# EAGLE design TIPO BLE (EAGLE 9.5.2)
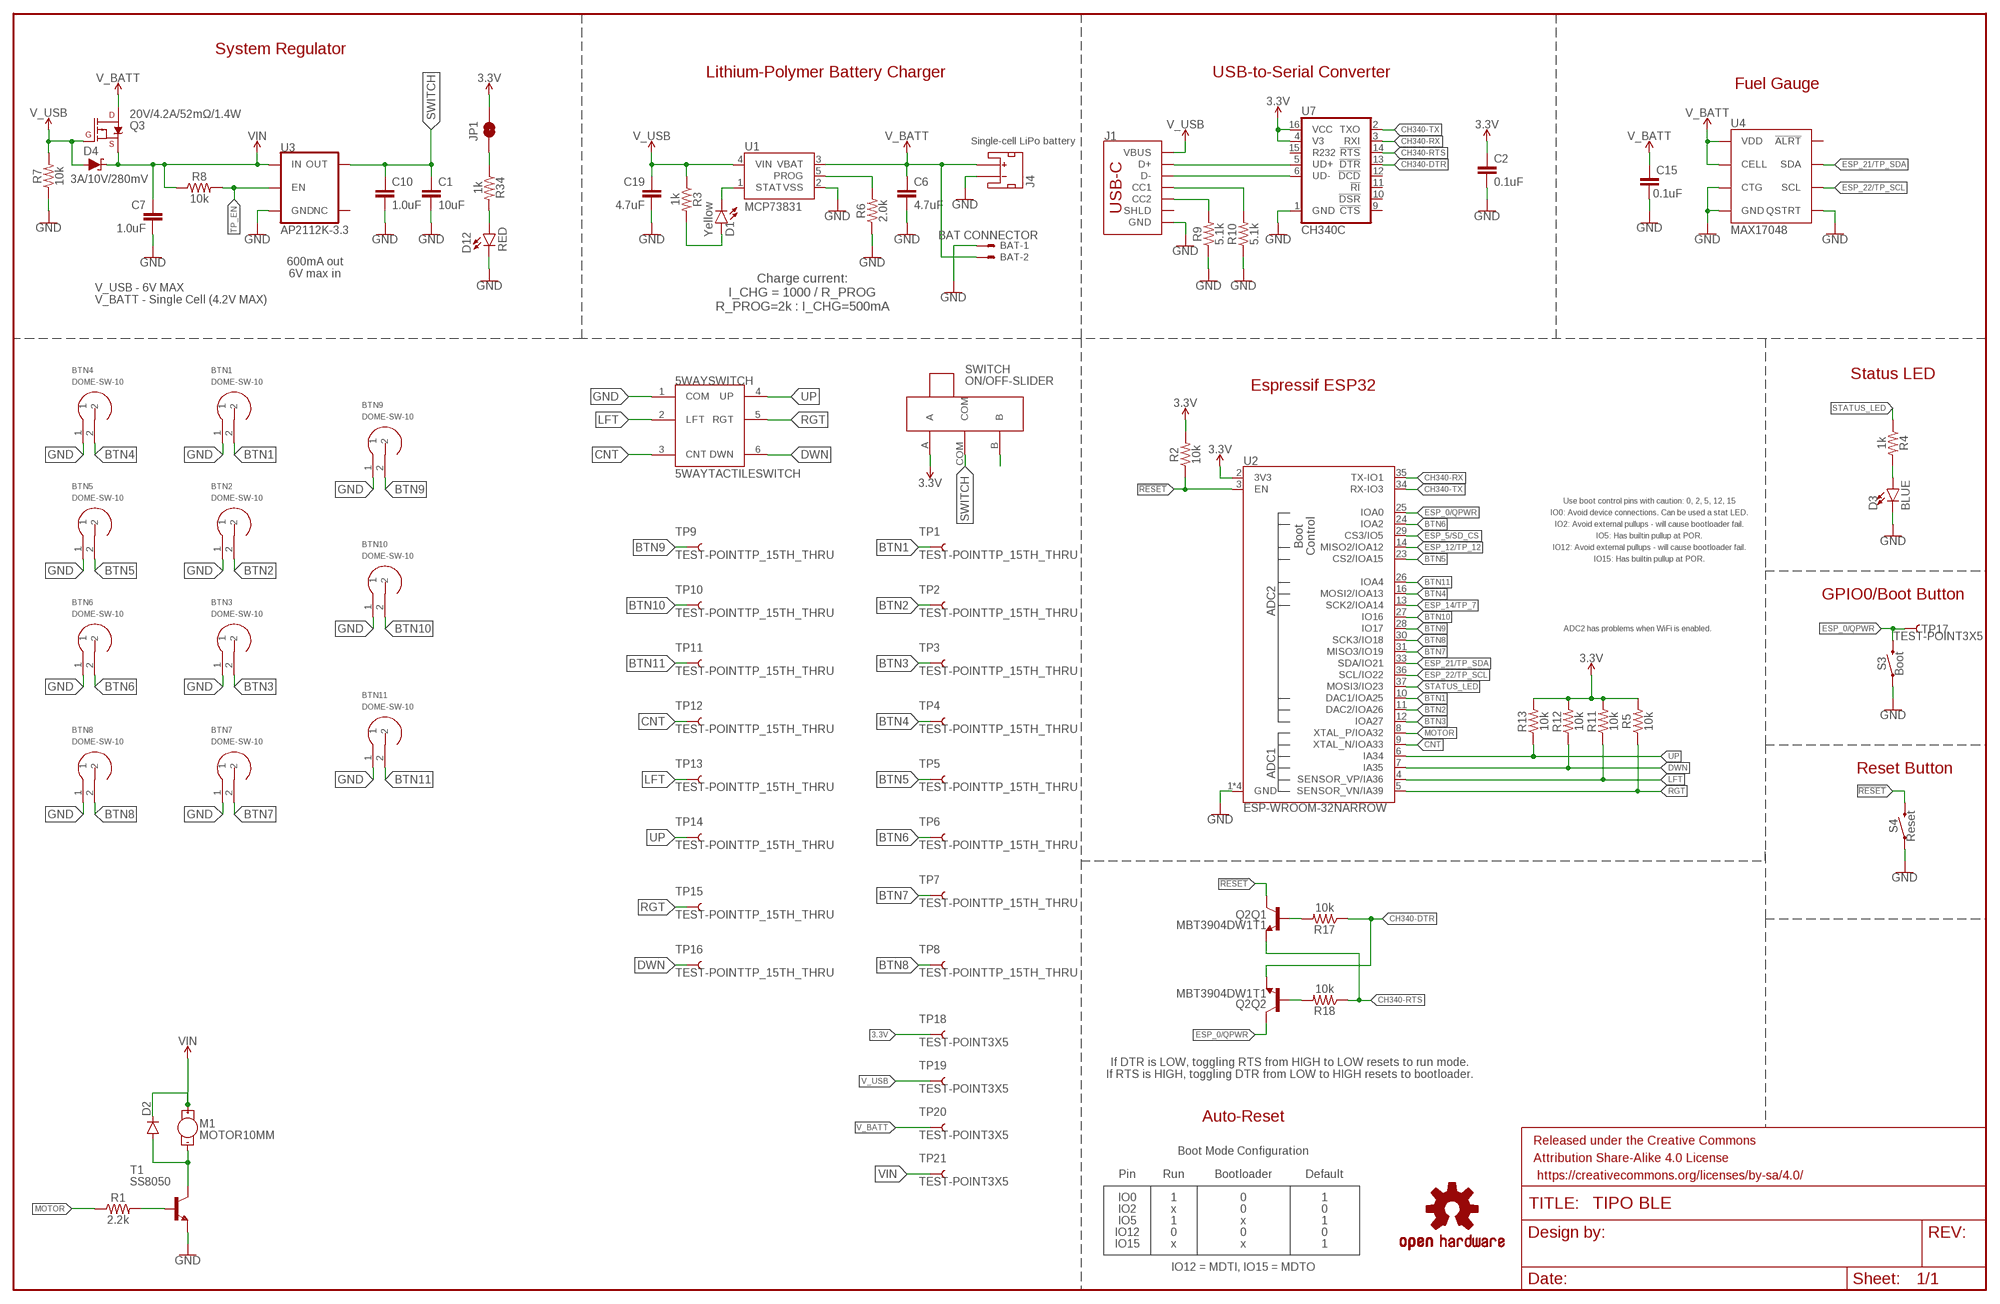
[diagram p0: schematic, sheet 1]

## Parts
5WAYSWITCH  5WAYTACTILESWITCH  [5WAYTACTILESWITCH]
BAT  BAT CONNECTOR  JST-XH-02-PIN-LONG-PAD  [JST-XH-02-PACKAGE-LONG-PAD]
BTN1  DOME-SW-10  [DOME-SW-10]
BTN2  DOME-SW-10  [DOME-SW-10]
BTN3  DOME-SW-10  [DOME-SW-10]
BTN4  DOME-SW-10  [DOME-SW-10]
BTN5  DOME-SW-10  [DOME-SW-10]
BTN6  DOME-SW-10  [DOME-SW-10]
BTN7  DOME-SW-10  [DOME-SW-10]
BTN8  DOME-SW-10  [DOME-SW-10]
BTN9  DOME-SW-10  [DOME-SW-10]
BTN10  DOME-SW-10  [DOME-SW-10]
BTN11  DOME-SW-10  [DOME-SW-10]
C1  10uF  10UF-0402T-6.3V-20%  [0402-TIGHT]
C2  0.1uF  0.1UF-0402T-6.3V-10%-X7R  [0402-TIGHT]
C6  4.7uF  4.7UF-0402_TIGHT-6.3V-20%-X5R  [0402-TIGHT]
C7  1.0uF  1.0UF-0402T-16V-10%  [0402-TIGHT]
C10  1.0uF  1.0UF-0402T-16V-10%  [0402-TIGHT]
C15  0.1uF  0.1UF-0402T-16V-10%  [0402-TIGHT]
C19  4.7uF  4.7UF-0603-35V-(20%)  [0603]
D1  Yellow  LED-YELLOW0603  [LED-0603]
D2  DIODE-DO-214AC  [DO-214AC]
D3  BLUE  LED-BLUE0603  [LED-0603]
D4  3A/10V/280mV  DIODE-SCHOTTKY-BAT60A  [SOD-323]
D12  RED  LED-RED0603  [LED-0603]
FRAME1  FRAME-LEDGER  [CREATIVE_COMMONS]
J1  USB_C_2-LAYER_PADS  [USB-C-16P-2LAYER-PADS]
J4  JST_2MM_MALE  [JST-2-SMD@1]
JP1  JUMPER-SMT_2_NC_TRACE_SILK  [SMT-JUMPER_2_NC_TRACE_SILK]
LOGO1  OSHW-LOGOL  [OSHW-LOGO-L]
M1  MOTOR10MM  [VIBE-MOTOR-10MM]
Q2  MBT3904DW1T1  TRANS_NPN_DUAL-MBT3904DW1T1  [SC70-6]
Q3  20V/4.2A/52mΩ/1.4W  MOSFET_PCH-DMG2305UX-7  [SOT23-3]
R1  2.2k  2.2KOHM-0603-1/10W-1%  [0603]
R2  10k  10KOHM-0402T-1/16W-1%  [0402-TIGHT]
R3  1k  1KOHM-0402T-1/16W-1%  [0402-TIGHT]
R4  1k  1KOHM-0402T-1/16W-1%  [0402-TIGHT]
R5  10k  10KOHM-0402T-1/16W-1%  [0402-TIGHT]
R6  2.0k  2.0KOHM-0603-1/10W-5%  [0603]
R7  10k  10KOHM-0402T-1/16W-1%  [0402-TIGHT]
R8  10k  10KOHM-0402T-1/16W-1%  [0402-TIGHT]
R9  5.1k  5.1KOHM-0402T-1/16W-1%  [0402-TIGHT]
R10  5.1k  5.1KOHM-0402T-1/16W-1%  [0402-TIGHT]
R11  10k  10KOHM-0402T-1/16W-1%  [0402-TIGHT]
R12  10k  10KOHM-0402T-1/16W-1%  [0402-TIGHT]
R13  10k  10KOHM-0402T-1/16W-1%  [0402-TIGHT]
R17  10k  10KOHM-0402T-1/16W-1%  [0402-TIGHT]
R18  10k  10KOHM-0402T-1/16W-1%  [0402-TIGHT]
R34  1k  1KOHM-0402T-1/16W-1%  [0402-TIGHT]
S3  Boot  MOMENTARY-SWITCH-SPST-SMD-4.6X2.8MM  [TACTILE_SWITCH_SMD_4.6X2.8MM]
S4  Reset  MOMENTARY-SWITCH-SPST-SMD-4.6X2.8MM  [TACTILE_SWITCH_SMD_4.6X2.8MM]
SWITCH  ON/OFF-SLIDER  [ON/OFF-SLIDER]
T1  SS8050  BC850  [SOT23]
TP1  TEST-POINTTP_15TH_THRU  [TP_15TH]
TP2  TEST-POINTTP_15TH_THRU  [TP_15TH]
TP3  TEST-POINTTP_15TH_THRU  [TP_15TH]
TP4  TEST-POINTTP_15TH_THRU  [TP_15TH]
TP5  TEST-POINTTP_15TH_THRU  [TP_15TH]
TP6  TEST-POINTTP_15TH_THRU  [TP_15TH]
TP7  TEST-POINTTP_15TH_THRU  [TP_15TH]
TP8  TEST-POINTTP_15TH_THRU  [TP_15TH]
TP9  TEST-POINTTP_15TH_THRU  [TP_15TH]
TP10  TEST-POINTTP_15TH_THRU  [TP_15TH]
TP11  TEST-POINTTP_15TH_THRU  [TP_15TH]
TP12  TEST-POINTTP_15TH_THRU  [TP_15TH]
TP13  TEST-POINTTP_15TH_THRU  [TP_15TH]
TP14  TEST-POINTTP_15TH_THRU  [TP_15TH]
TP15  TEST-POINTTP_15TH_THRU  [TP_15TH]
TP16  TEST-POINTTP_15TH_THRU  [TP_15TH]
TP17  TEST-POINT3X5  [PAD.03X.05]
TP18  TEST-POINT3X5  [PAD.03X.05]
TP19  TEST-POINT3X5  [PAD.03X.05]
TP20  TEST-POINT3X5  [PAD.03X.05]
TP21  TEST-POINT3X5  [PAD.03X.05]
U1  MCP73831  [SOT23-5]
U2  ESP-WROOM-32NARROW  [ESP-WROOM-32-NARROW]
U3  AP2112K-3.3  V_REG_AP2112K-3.3V  [SOT23-5]
U4  MAX17048  MAX17048DFN8  [DFN-8]
U7  CH340C  [SO016]

## Nets
3.3V [power]: C2.1 JP1.2 R2.2 R5.2 R11.2 R12.2 R13.2 SWITCH.A TP18.1 U2.2(3V3) U7.4(V3) U7.16(VCC)
!RESET!: Q2.3(Q1:C) R2.1 S4.3 S4.4 U2.3(EN)
BTN1: BTN1.2 TP1.1 U2.10(DAC1/IOA25)
BTN2: BTN2.2 TP2.1 U2.11(DAC2/IOA26)
BTN3: BTN3.2 TP3.1 U2.12(IOA27)
BTN4: BTN4.2 TP4.1 U2.16(MOSI2/IOA13)
BTN5: BTN5.2 TP5.1 U2.23(CS2/IOA15)
BTN6: BTN6.2 TP6.1 U2.24(IOA2)
BTN7: BTN7.2 TP7.1 U2.31(MISO3/IO19)
BTN8: BTN8.2 TP8.1 U2.30(SCK3/IO18)
BTN9: BTN9.2 TP9.1 U2.28(IO17)
BTN10: BTN10.2 TP10.1 U2.27(IO16)
BTN11: BTN11.2 TP11.1 U2.26(IOA4)
CH340-DTR: Q2.1(Q2:E) R17.1 U7.13(!DTR)
CH340-RTS: Q2.4(Q1:E) R18.1 U7.14(!RTS)
CH340-RX: U2.35(TX-IO1) U7.3(RXI)
CH340-TX: U2.34(RX-IO3) U7.2(TXO)
CHG: D1.C U1.1(STAT)
CHG_LED: D1.A R3.2
CNT: 5WAYSWITCH.3(CNT) TP12.1 U2.9(XTAL_N/IOA33)
D+: J1.A6(D+) J1.B6(D+) U7.5(UD+)
D-: J1.A7(D-) J1.B7(D-) U7.6(UD-)
DTR-10K: Q2.5(Q1:B) R17.2
DWN: 5WAYSWITCH.6(DWN) R12.1 TP16.1 U2.7(IA35)
ESP_0/QPWR: Q2.6(Q2:C) S3.3 S3.4 TP17.1 U2.25(IOA0)
ESP_5/SD_CS: U2.29(CS3/IO5)
ESP_12/TP_12: U2.14(MISO2/IOA12)
ESP_14/TP_7: U2.13(SCK2/IOA14)
ESP_21/TP_SDA: U2.33(SDA/IO21) U4.8(SDA)
ESP_22/TP_SCL: U2.36(SCL/IO22) U4.7(SCL)
GND: 5WAYSWITCH.1(COM) BAT.1 BTN1.1 BTN2.1 BTN3.1 BTN4.1 BTN5.1 BTN6.1 BTN7.1 BTN8.1 BTN9.1 BTN10.1 BTN11.1 C1.2 C2.2 C6.2 C7.2 C10.2 C15.2 C19.2 D3.C D12.C J1.GND J1.GND2(GND) J4.1(-) R6.1 R7.1 R9.1 R10.1 S3.1 S3.2 S4.1 S4.2 T1.2(E) U1.2(VSS) U2.1(GND) U2.15(GND) U2.38(GND) U2.GND U3.2(GND) U4.1(CTG) U4.4(GND) U4.6(QSTRT) U4.9(GND) U7.1(GND)
LFT: 5WAYSWITCH.2(LFT) R11.1 TP13.1 U2.4(SENSOR_VP/IA36)
MOTOR: R1.1 U2.8(XTAL_P/IOA32)
N$1: R1.2 T1.1(B)
N$2: SWITCH.B
N$3: D2.A M1.- T1.3(C)
N$4: JP1.1 R34.1
N$5: J1.B5(CC2) R9.2
N$6: J1.A5(CC1) R10.2
N$7: D3.A R4.2
N$14: R6.2 U1.5(PROG)
N$30: D12.A R34.2
RGT: 5WAYSWITCH.5(RGT) R5.1 TP15.1 U2.5(SENSOR_VN/IA39)
RTS-10K: Q2.2(Q2:B) R18.2
STATUS_LED: R4.1 U2.37(MOSI3/IO23)
SWITCH [power]: C1.1 C10.1 SWITCH.COM U3.5(OUT)
TP_EN: R8.2 U3.3(EN)
UP: 5WAYSWITCH.4(UP) R13.1 TP14.1 U2.6(IA34)
V_BATT [power]: BAT.2 C6.1 C15.1 J4.2(+) Q3.3(D) TP20.1 U1.3(VBAT) U4.2(CELL) U4.3(VDD)
V_USB [power]: C19.1 D4.A J1.VBUS1(VBUS) J1.VBUS2(VBUS) Q3.1(G) R3.1 R7.2 TP19.1 U1.4(VIN)
VIN [power]: C7.1 D2.C D4.C M1.+ Q3.2(S) R8.1 TP21.1 U3.1(IN)
Unconnected: J1.SHLD1(SHLD) J1.SHLD2(SHLD) J1.SHLD3(SHLD) J1.SHLD4(SHLD) J4.NC1(PAD1) J4.NC2(PAD2) U3.4(NC) U4.5(!ALRT) U7.9(!CTS) U7.10(!DSR) U7.11(!RI) U7.12(!DCD) U7.15(R232)

## Notes on the sheet
- System Regulator
- Lithium-Polymer Battery Charger | USB-to-Serial Converter
- Fuel Gauge
- Single-cell LiPo battery
- 600mA out
  6V max in
- Charge current:
  I_CHG = 1000 / R_PROG
  R_PROG=2k : I_CHG=500mA
- V_USB - 6V MAX
  V_BATT - Single Cell (4.2V MAX)
- Status LED
- Espressif ESP32
- Use boot control pins with caution: 0, 2, 5, 12, 15
- IO0: Avoid device connections. Can be used a stat LED.
- IO2: Avoid external pullups - will cause bootloader fail.
- IO5: Has builtin pullup at POR.
- IO12: Avoid external pullups - will cause bootloader fail.
- IO15: Has builtin pullup at POR.
- GPIO0/Boot Button
- ADC2 has problems when WiFi is enabled.
- Reset Button
- If DTR is LOW, toggling RTS from HIGH to LOW resets to run mode.
  If RTS is HIGH, toggling DTR from LOW to HIGH resets to bootloader.
- Auto-Reset
- Boot Mode Configuration
- Pin | Run | Bootloader | Default
- IO0 | 1 | 0 | 1
- IO2 | x | 0 | 0
- IO5 | 1 | x | 1
- IO12 | 0 | 0 | 0
- IO15 | x | x | 1
- IO12 = MDTI, IO15 = MDTO

## Library data of the parts
5WAYSWITCH = tipo-switch:5WAYTACTILESWITCH: Sometimes you want a small input and a single button just won’t fit it. A 5-way tactile switch allows for a joystick-like interface in a very small package. These are surface mount, but easily soldered. This navigation switch is an intuitive way to add 5 button's worth of interfacing with a single component. Inside is 5 switches: left, right, up, down and 'select' (pressing down), all with a common ground pin. https://www.sunrom.com/p/5-way-tactile-switch-10x10x9mm
BAT = Rembrandt Electronics - JST XH Connectors v1-0:JST-XH-02-PIN: JST XH Connector 2 Pin Wire to board connector. Pitch: 2,54 mm, (0.100") Number of pins: 2 Created by Rembrandt Electronics www.rembrandtelectronics.com
BTN1-BTN11 = tipo-switch:DOME-SW-10: Dome Switch 10mm https://www.sunrom.com/p/dome-switch-round-10mm
C1 = SparkFun-Capacitors:10UF: 10.0µF ceramic capacitors A capacitor is a passive two-terminal electrical component used to store electrical energy temporarily in an electric field.; PROD_ID: CAP-14848
C2 = SparkFun-Capacitors:0.1UF: 0.1µF ceramic capacitors A capacitor is a passive two-terminal electrical component used to store electrical energy temporarily in an electric field.; PROD_ID: CAP-14993
C6 = SparkFun-Capacitors:4.7UF: 4.7µF ceramic capacitors A capacitor is a passive two-terminal electrical component used to store electrical energy temporarily in an electric field.; PROD_ID: CAP-14240
C7 C10 = SparkFun-Capacitors:1.0UF: 1µF ceramic capacitors A capacitor is a passive two-terminal electrical component used to store electrical energy temporarily in an electric field.; PROD_ID: CAP-12417
C15 = SparkFun-Capacitors:0.1UF: 0.1µF ceramic capacitors A capacitor is a passive two-terminal electrical component used to store electrical energy temporarily in an electric field.; PROD_ID: CAP-12416
C19 = SparkFun-Capacitors:4.7UF: 4.7µF ceramic capacitors A capacitor is a passive two-terminal electrical component used to store electrical energy temporarily in an electric field.; PROD_ID: CAP-14106
D1 = SparkFun-LED:LED-YELLOW: Yellow SMD LED Used in manufacturing several products at SparkFun. Packages: 0603 - SMD 0603 package[Product Link] <http://www.kingbrightusa.com/product.asp?catalog_name=LED&product_id=APT1608SYCK> 0603 -SMART - SMART SMD 0603 package (more efficient/more expensive) [Product Link] <http://www.osram-os.com/osram_os/en/products/product-catalog/led-light-emitting-diodes/smartled-0603/ly-l29k/index.jsp> LilyPad - SMD1206 package[Product Datasheet] <https://www.sparkfun.com/datasheets/DevTools/LilyPad/Q150YUS4.pdf> SparkFun Products: Blynk Board <https://www.sparkfun.com/products/13794> IOIO-OTG <https://www.sparkfun.com/products/13613> XBee Explorer Serial <https://www.sparkfun.com/products/13225>; PROD_ID: DIO-09003
D2 = diode:DIODE-: DIODE
D3 = SparkFun-LED:LED-BLUE: Blue SMD LED Used in manufacturing of various products at SparkFun Packages: 0603 - SMD 0603 package [Product Link] <http://www.digikey.com/product-detail/en/SMLE12BC7TT86/511-1589-2-ND/1641808> 1206 - SMD1206 package [Product Link] <http://www.digikey.com/product-detail/en/lite-on-inc/LTST-C150TBKT/160-1643-1-ND/573584> SparkFun Products: ESP8266 Thing-Dev Board <https://www.sparkfun.com/products/13711> RedBoard <https://www.sparkfun.com/products/12757>; PROD_ID: DIO-08575
D4 = SparkFun-DiscreteSemi:DIODE-SCHOTTKY: Schottky diode A Schottky diode is a semiconductor diode which has a low forward voltage drop and a very fast switching action.; PROD_ID: DIO-14072
D12 = SparkFun-LED:LED-RED: Red SMD LED Used in manufacturing of most products at SparkFun Packages: 0603 - SMD 0603 package [Product Link] <http://docs.avagotech.com/docs/AV02-0551EN> 0603 SMART - SMD 0603 SMART package ( more efficient and expensive)[Product Link] <http://www.osram-os.com/Graphics/XPic2/00077099_0.pdf> 1206 - SMD1206 package [Product Link] <https://www.sparkfun.com/datasheets/DevTools/LilyPad/Q150OVS4.pdff> SparkFun Products: Pro Mini 328 -5V <https://www.sparkfun.com/products/821> RedBoard <https://www.sparkfun.com/products/12757> IOIO-OTG <https://www.sparkfun.com/products/13613>; PROD_ID: DIO-00819
FRAME1 = SparkFun-Aesthetics:FRAME-LEDGER: Schematic Frame - Ledger Standard 11x14 US Ledger frame
J1 = SparkFun-Connectors:USB_C: USB Type C 16Pin Connector Super Speed pins not available on the 16-pin purely SMD connector so this part is best for USB 2.0 implementations. D1 and D2 are tied together enabling D+/- no matter which way the cable is plugged into the connector. The two channel configuration pins (CC1/2) are exposed. These are normally connected to ground via 5.1k resistors but can be reconfigured for high current/high power applications. **4-LAYER BOARD WARNING!!** If designing 4-layer board, make sure to select the variant _4-LAYER-ISOLATED. The linked footprint (USB-C-16-4LAYER-ISOLATED) includes some very necessary cutout polygons in the inner layers (2 and 15). This prevents the PTH mounting shield legs on the USB connector from electrically connecting any other polygons on the inner layers (usually VCC and GND).; PROD_ID: CONN-14122
J4 = SparkFun-Connectors:JST_2MM_MALE: JST 2MM MALE RA CONNECTOR Two pin, compact surface mount connector. Commonly used as a battery input connection point. We really like the solid locking feeling and high current rating on these small connectors. We use these all the time as battery connectors. Mates to single-cell LiPo batteries. Here is the connector we sell at SparkFun: JST Right Angle Connector - White (PRT-08612) Datasheet It was used on these SparkFun products: SparkFun MOSFET Power Controller (PRT-11214) SparkFun Battery Babysitter - LiPo Battery Manager (PRT-13777) And many, many others that required a lipo battery connection.; PROD_ID: CONN-11443; SF_ID: PRT-08612
JP1 = SparkFun-Jumpers:JUMPER-SMT_2_NC_TRACE: Normally closed trace jumper This jumper has a trace between two pads so it's normally closed (NC). Use a razor knife to open the connection. For best results follow the IPC guidelines for cutting traces: Cutout at least 0.063 mm (0.005 in). Remove all loose material to clean up the cut area. Seal the cut with an approved epoxy. Reapply solder to reclose the connection.
LOGO1 = SparkFun-Aesthetics:OSHW-LOGO: Open-Source Hardware (OSHW) Logo This logo indicates the piece of hardware it is found on incorporates a OSHW license and/or adheres to the definition of open source hardware found here: http://freedomdefined.org/OSHW
M1 = SparkFun-Electromechanical:MOTOR: Motor (Single-Phase) Two-terminal, single-phase motors. SparkFun Products Vibration Motor (ROB-08449) Physical dimension and wire connections for this powerful vibration motor. Motor has a self adhesive backing.; PROD_ID: COMP-08572; SF_SKU: ROB-08449
Q2 = SparkFun-DiscreteSemi:TRANS_NPN_DUAL: Dual NPN Transistors in Single Package The MBT3904W1 puts two general purpose 3904 NPN transistors in a single package. Datasheet <http://www.onsemi.com/pub_link/Collateral/MBT3904DW1T1-D.PDF> SparkFun Products: SparkFun ESP32 Thing <https://www.sparkfun.com/products/13907>; PROD_ID: TRANS-13337
Q3 = SparkFun-DiscreteSemi:MOSFET_PCH: P-channel MOSFETs Voltage controlled devices that allow control of high current outputs. SparkFun Products: SparkFun ESP32 Thing <https://www.sparkfun.com/products/13907> SparkFun ESP8266 Thing <https://www.sparkfun.com/products/13231> SparkFun Pi Servo HAT V2 <https://www.sparkfun.com/products/15316> DMG2305UX-7 (20V/4.2A/SOT23-3); PROD_ID: TRAN-14388
R1 = SparkFun-Resistors:2.2KOHM: 2.2kΩ resistor A resistor is a passive two-terminal electrical component that implements electrical resistance as a circuit element. Resistors act to reduce current flow, and, at the same time, act to lower voltage levels within circuits. - Wikipedia; PROD_ID: RES-08272
R2 R5 R7 R8 R11-R13 R17 R18 = SparkFun-Resistors:10KOHM: 10kΩ resistor A resistor is a passive two-terminal electrical component that implements electrical resistance as a circuit element. Resistors act to reduce current flow, and, at the same time, act to lower voltage levels within circuits. - Wikipedia; PROD_ID: RES-14241
R3 R4 R34 = SparkFun-Resistors:1KOHM: 1kΩ resistor A resistor is a passive two-terminal electrical component that implements electrical resistance as a circuit element. Resistors act to reduce current flow, and, at the same time, act to lower voltage levels within circuits. - Wikipedia; PROD_ID: RES-14342
R6 = SparkFun-Resistors:2.0KOHM: 2kΩ resistor A resistor is a passive two-terminal electrical component that implements electrical resistance as a circuit element. Resistors act to reduce current flow, and, at the same time, act to lower voltage levels within circuits. - Wikipedia; PROD_ID: RES-08296
R9 R10 = SparkFun-Resistors:5.1KOHM; PROD_ID: RES-14340
S3 S4 = SparkFun-Switches:MOMENTARY-SWITCH-SPST: Momentary Switch (Pushbutton) - SPST Normally-open (NO) SPST momentary switches (buttons, pushbuttons). Variants PTH-12MM - 12mm square, through-hole Momentary Pushbutton Switch - 12mm Square (COM-09190) PTH-6.0MM, PTH-6.0MM-KIT - 6.0mm square, through-hole Mini Pushbutton Switch (COM-00097) KIT package intended for soldering kit's - only one side of pads' copper is exposed. PTH-RIGHT-ANGLE-KIT - Right-angle, through-hole Right Angle Tactile Button - Used on SparkFun BigTime Watch Kit SMD-12MM - 12mm square, surface-mount Tactile Button - SMD (12mm) (COM-12993) Used on SparkFun PicoBoard SMD-4.5MM - 4.5mm Square Trackball Switch Used on SparkFun Blackberry Trackballer Breakout SMD-4.6MMX2.8MM - 4.60mm x 2.80mm, surface mount Used on SparkFun SAMD21 Mini Breakout SMD-5.2MM, SMD-5.2-REDUNDANT - 5.2mm square, surface-mount Mini Pushbutton Switch - SMD (COM-08720) Used on Arduino Pro Mini REDUNDANT package connects both switch circuits together SMD-6.0X3.5MM - 6.0 x 3.5mm, surface mount Momentary Reset Switch SMD (COM-08229) SMD-6.2MM-TALL - 6.2mm square, surface mount Tactile Button - SMD (6mm) Used on SparkFun Digital Sandbox SMD-RIGHT-ANGLE - Right-angle, surface mount Used on SparkFun Block for Intel® Edison - Arduino; PROD_ID: SWCH-15606
SWITCH = tipo-switch:ON/OFF-SLIDER
T1 = transistor:BC850: NPN TRANSISTOR
TP1-TP21 = SparkFun-Connectors:TEST-POINT: SparkFun Test Points Bare copper test points for troubleshooting or In-Circuit-Testing. These are used by our Production team for verifying production board runs using pogo-pins on test beds. SparkFun Products: SparkFun LSM9DS1 Breakout <https://www.sparkfun.com/products/13284> SparkFun PSOC <https://www.sparkfun.com/products/13714> SparkFun Load Cell Amplifier <https://www.sparkfun.com/products/13879>
U1 = SparkFun-PowerIC:MCP73831: Miniature single cell, fully integrated Li-Ion, Li-polymer charge management controller http://ww1.microchip.com/downloads/en/DeviceDoc/20001984g.pdf IC-09995; PROD_ID: IC-09995
U2 = SparkFun-RF:ESP-WROOM-32; PROD_ID: IC-13849
U3 = SparkFun-IC-Power:V_REG_AP2112: AP2112 - 600mA CMOS LDO Regulator w/ Enable The AP2112 is CMOS process low dropout linear regulator with enable function, the regulator delivers a guaranteed 600mA (min.) continuous load current. Features Output Voltage Accuracy: ±1.5% Output Current: 600mA (Min.) Foldback Short Current Protection: 50mA Enable Function to Turn ON/OFF VOUT Low Dropout Voltage (3.3V): 250mV (Typ.) @IOUT=600mA Excellent Load Regulation: 0.2%/A (Typ.) Excellent Line Regulation: 0.02%/V (Typ.) Low Quiescent Current: 55μA (Typ.) Low Standby Current: 0.01μA (Typ.) Low Output Noise: 50μVRMS PSRR: 100Hz -65dB, 1kHz -65dB OTSD Protection Stable with 1.0μF Flexible Cap: Ceramic, Tantalum and Aluminum Electrolytic Operation Temperature Range: -40°C to 85°C ESD: MM 400V, HBM 4000V; PROD_ID: VREG-12457; VALUE: 3.3V
U4 = SparkFun-IC-Power:MAX17048: Micropower 1-Cell Li+ ModelGauge SparkFun Products Qduino Mini (DEV-13614); PROD_ID: IC-12551
U7 = SparkFun-IC-Comms:CH340C; PROD_ID: IC-14038

## Net classes
1 power: width 0.305 mm, drill 0.305 mm

## Board
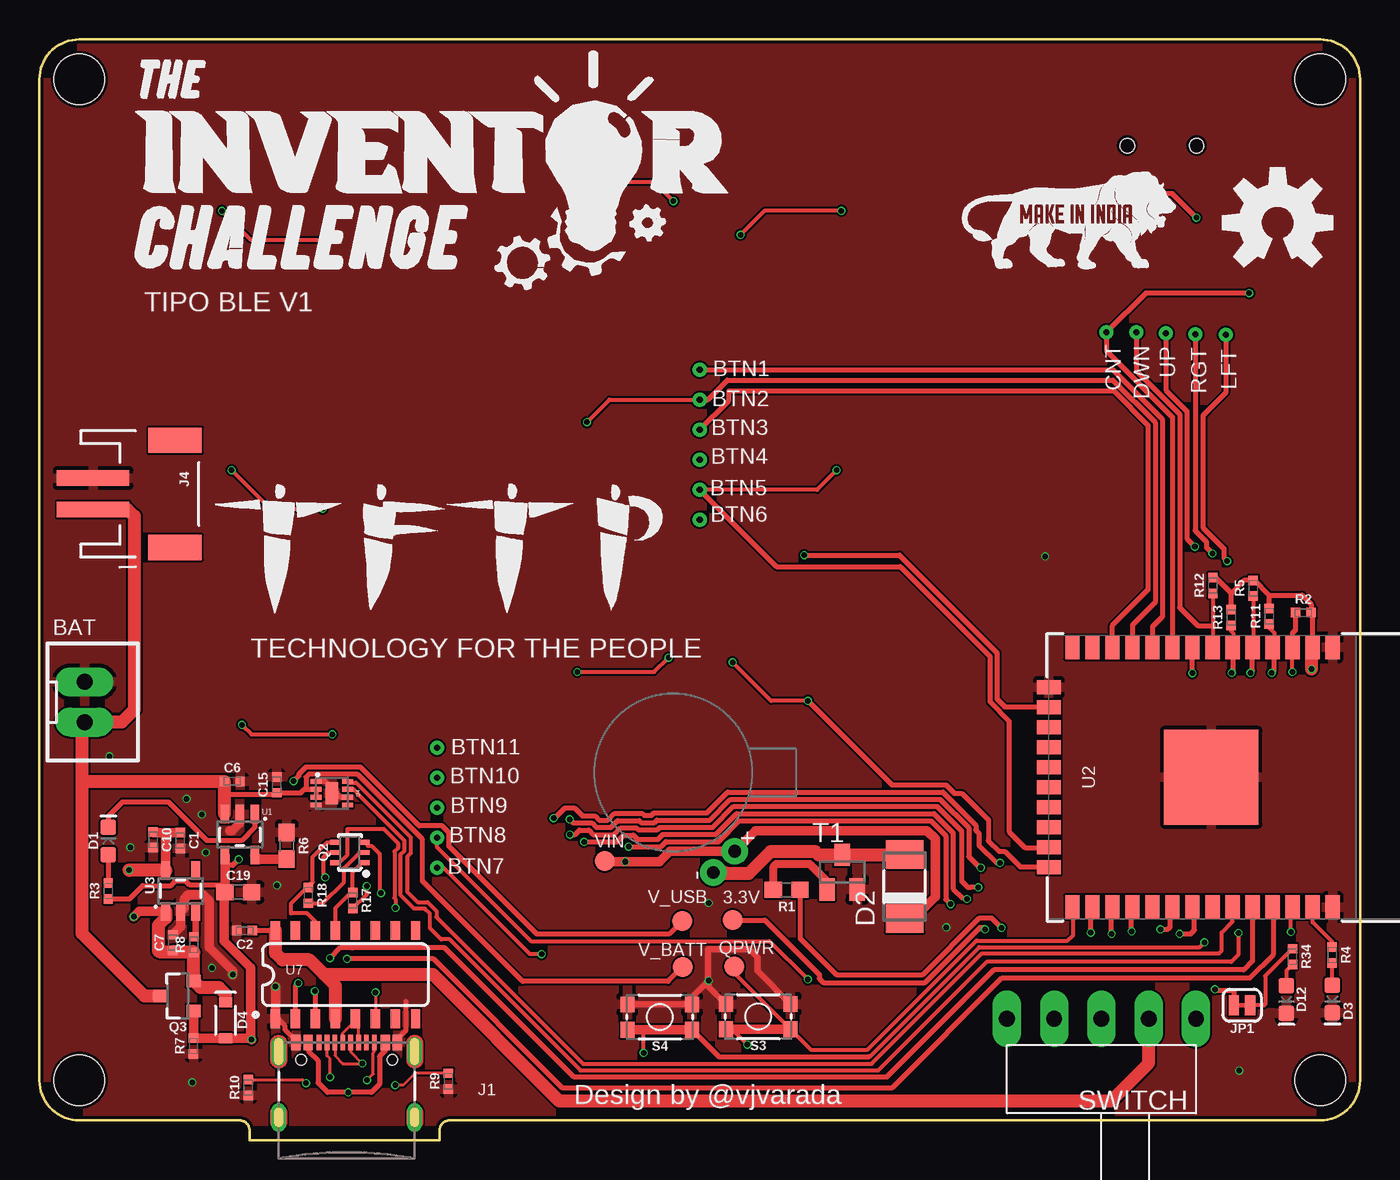
[diagram p1: board, top side]
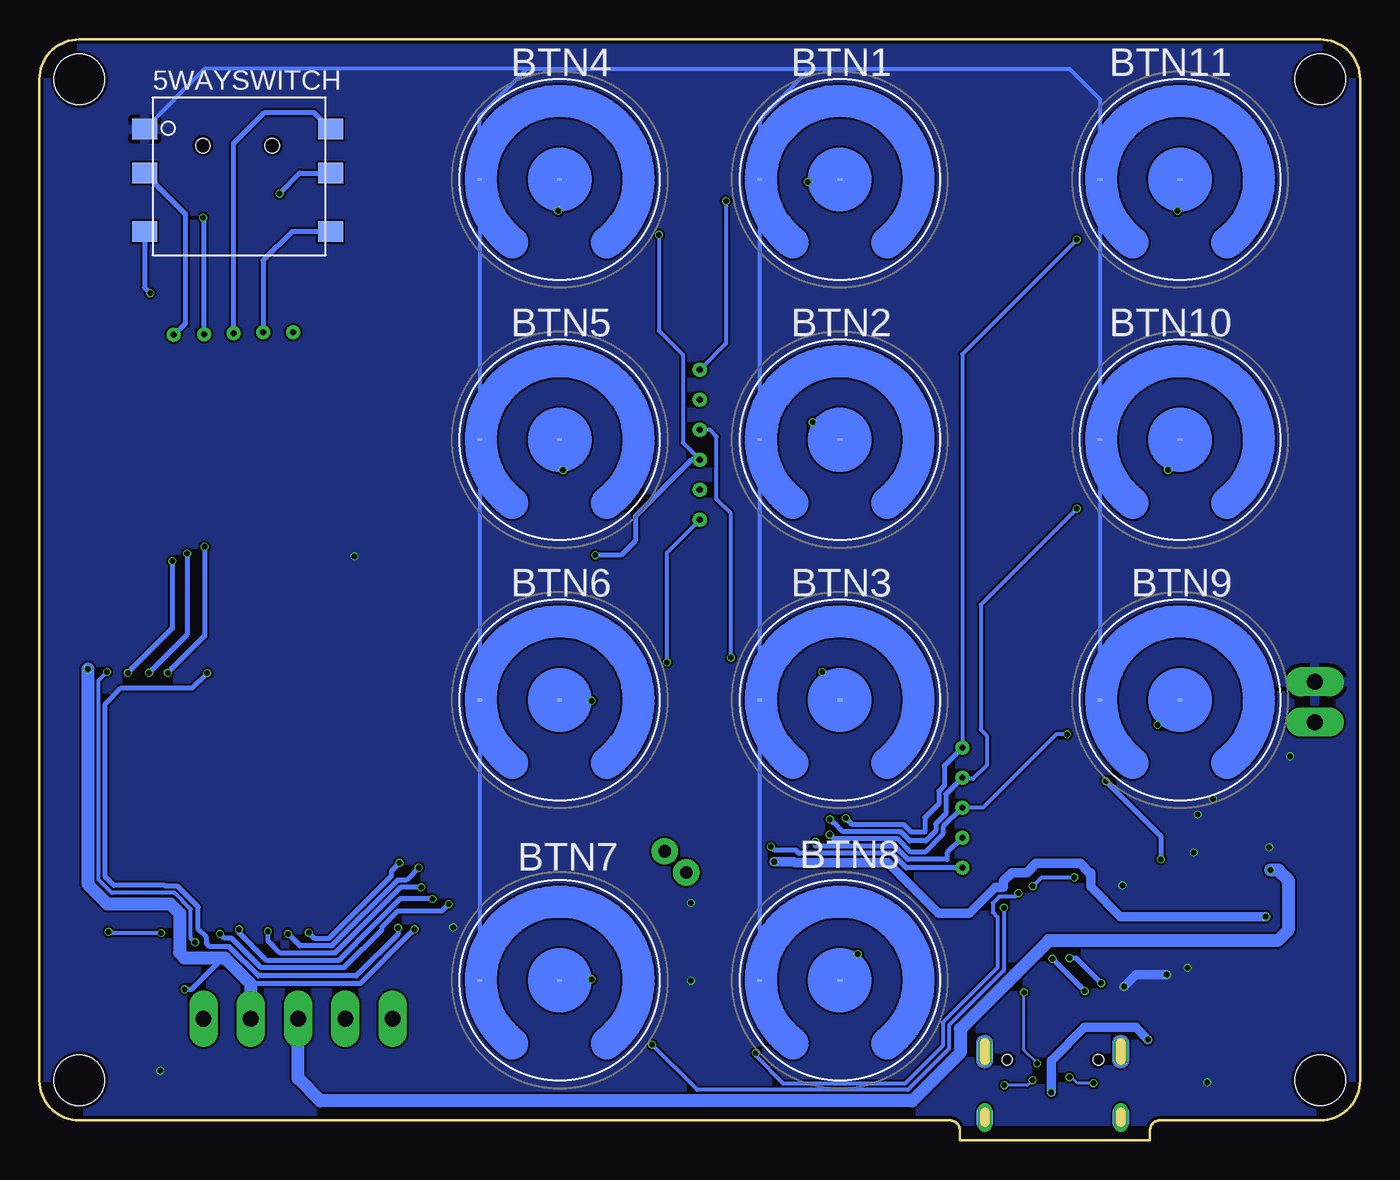
[diagram p2: board, bottom side, seen from below]

Size 83.82 x 69.85 mm. Coordinates in mm from the lower left corner, seen from the top.
Outline: 83.82,67.31 arc90 81.28,69.85 2.54,69.85 arc90 0,67.31 0,3.81 arc90 2.54,1.27 12.7,1.27 arc-90 13.34,0.63 13.34,0 25.4,0 25.4,0.63 arc-90 26.04,1.27 81.28,1.27 arc90 83.82,3.81 83.82,67.31
Copper layers (1*16): Top 0.035mm / dielectric 1.6mm / Bottom 0.035mm
Design rules "jlcpcb-2layers": minimum track width 5mil, minimum drill 0.3mm, track to track 5mil, track to pad 5mil, pad to pad 5mil, via to via 5mil, smd to smd 5mil, copper to edge 0.2mm, drill to drill 6mil, minimum pad ring 10mil, minimum via ring 3mil, stop-mask expansion 4mil, vias tented up to drill 0mil, thermal gap 10mil
Holes 3.2 mm at 2.54,3.81 2.54,67.31 81.28,3.81 81.28,67.31

### Footprints (pad centres in the part's own frame; a part is rotated, then mirrored left to right if it is on the bottom)
5WAYTACTILESWITCH = smd 1.6 x 1.3: 1 0,0; 2 0,-2.8; 3 0,-6.5; 4 11.8,0; 5 11.8,-2.8; 6 11.8,-6.5 | hole 0.9: 3.7,-1.05; 8.1,-1.05
JST-XH-02-PACKAGE-LONG-PAD = drill 1.016 long: 1 -1.27,0; 2 1.27,0
DOME-SW-10 = smd 0.305 x 0.152: 1 -5.08,0; 2 0,0
0402-TIGHT = smd 0.6 x 0.6: 1 -0.5,0; 2 0.5,0
0603 = smd 1.1 x 1: 1 -0.85,0; 2 0.85,0
LED-0603 = smd 1 x 1: A -0.877,0; C 0.877,0
DO-214AC = smd 1.8 x 2.4: A 2.025,0; C -2.025,0
SOD-323 = smd 0.63 x 0.83: A 1.15,0; C -1.15,0
USB-C-16P-2LAYER-PADS = smd 0.3 x 1: A5 -1.25,-0.34; A6 -0.25,-0.34; A7 0.25,-0.34; A8 1.25,-0.34; B5 1.75,-0.34; B6 0.75,-0.34; B7 -0.75,-0.34; B8 -1.75,-0.34 | smd 0.6 x 1: GND -3.225,-0.34; GND2 3.225,-0.34; VBUS1 -2.45,-0.34; VBUS2 2.45,-0.34 | drill 0.4 pad 0.6 long: SHLD1 -4.318,-0.915; SHLD2 4.318,-0.915; SHLD3 -4.318,-5.095; SHLD4 4.318,-5.095 | hole 0.65: -2.89,-1.445; 2.89,-1.445
JST-2-SMD@1 = smd 1 x 4.6: 1 -1,-3.7; 2 1,-3.7 | smd 1.6 x 3.4: NC1 -3.4,1.5; NC2 3.4,1.5
SMT-JUMPER_2_NC_TRACE_SILK = smd 0.66 x 1.27: 1 -0.521,0; 2 0.521,0
VIBE-MOTOR-10MM = drill 0.8 pad 1.676: + -5,-3.9; - -6.35,-2.54
SC70-6 = smd 0.3 x 0.66: 1 -0.65,-0.92; 2 0,-0.92; 3 0.65,-0.92; 4 0.65,0.92; 5 0,0.92; 6 -0.65,0.92
SOT23-3 = smd 0.8 x 0.9: 1 -0.95,-1; 2 0.95,-1; 3 0,1.1
TACTILE_SWITCH_SMD_4.6X2.8MM = smd 0.9 x 1: 1 -2.05,-0.8; 2 2.05,-0.8; 3 2.05,0.8; 4 -2.05,0.8
ON/OFF-SLIDER = drill 1 long: A 3,0; B 9,0; COM 6,0; P$1 0,0; P$5 12,0
SOT23 = smd 1 x 1.4: 1 -0.95,-1.1; 2 0.95,-1.1; 3 0,1.1
TP_15TH = drill 0.381 pad 0.61: 1 0,0
PAD.03X.05 = smd 1.27 x 1.27: 1 0,0
SOT23-5 = smd 0.55 x 1.2: 1 -0.95,-1.3; 2 0,-1.3; 3 0.95,-1.3; 4 0.95,1.3; 5 -0.95,1.3
ESP-WROOM-32-NARROW = smd 0.9 x 1.5: 1 6.43,8.238; 2 5.16,8.238; 3 3.89,8.238; 4 2.62,8.238; 5 1.35,8.238; 6 0.08,8.238; 7 -1.19,8.238; 8 -2.46,8.238; 9 -3.73,8.238; 10 -5,8.238; 11 -6.27,8.238; 12 -7.54,8.238; 13 -8.81,8.238; 14 -10.08,8.238; 25 -10.08,-8.238; 26 -8.81,-8.238; 27 -7.54,-8.238; 28 -6.27,-8.238; 29 -5,-8.238; 30 -3.73,-8.238; 31 -2.46,-8.238; 32 -1.19,-8.238; 33 0.08,-8.238; 34 1.35,-8.238; 35 2.62,-8.238; 36 3.89,-8.238; 37 5.16,-8.238; 38 6.43,-8.238 | smd 1.5 x 0.9: 15 -11.57,5.715; 16 -11.57,4.445; 17 -11.57,3.175; 18 -11.57,1.905; 19 -11.57,0.635; 20 -11.57,-0.635; 21 -11.57,-1.905; 22 -11.57,-3.175; 23 -11.57,-4.445; 24 -11.57,-5.715 | smd 6 x 6: GND -1.27,0
DFN-8 = smd 0.3 x 0.7: 1 -0.75,-0.99; 2 -0.25,-0.99; 3 0.25,-0.99; 4 0.75,-0.99; 5 0.75,0.99; 6 0.25,0.99; 7 -0.25,0.99; 8 -0.75,0.99 | smd 1.38 x 0.8: 9 0,0
SO016 = smd 0.6 x 1.2: 1 -4.445,-2.8; 2 -3.175,-2.8; 3 -1.905,-2.8; 4 -0.635,-2.8; 5 0.635,-2.8; 6 1.905,-2.8; 7 3.175,-2.8; 8 4.445,-2.8; 9 4.445,2.8; 10 3.175,2.8; 11 1.905,2.8; 12 0.635,2.8; 13 -0.635,2.8; 14 -1.905,2.8; 15 -3.175,2.8; 16 -4.445,2.8

### Placement (x,y rotation side)
5WAYSWITCH  77.14,64.16 0 bottom
BAT  2.87,27.81 270 top
BTN1  33.02,60.96 0 bottom
BTN2  33.02,44.45 0 bottom
BTN3  33.02,27.94 0 bottom
BTN4  50.8,60.96 0 bottom
BTN5  50.8,44.45 0 bottom
BTN6  50.8,27.94 0 bottom
BTN7  33.02,10.16 0 bottom
BTN8  50.8,10.16 0 bottom
BTN9  11.43,27.94 0 bottom
BTN10  11.43,44.45 0 bottom
BTN11  11.43,60.96 0 bottom
C1  8.94,19.02 270 top
C2  13.03,13.31 180 top
C6  12.24,22.78 0 top
C7  8.47,12.55 90 top
C10  7.21,19.08 270 top
C15  15.06,22.56 90 top
C19  12.62,15.75 0 top
D1  4.37,19 90 top
D2  54.91,16.1 90 top
D3  82.07,8.97 270 top
D4  11.81,7.62 270 top
D12  79.15,8.94 270 top
FRAME1  43.64,-20.68 0 top  (outside the outline)
J1  19.51,6.55 0 top
J4  7.11,41.02 270 top
JP1  76.33,8.56 180 top
LOGO1  78.59,58.22 0 top
M1  40.23,23.34 90 top
Q2  19.71,18.26 90 top
Q3  8.79,9.17 90 top
R1  47.42,15.9 180 top
R2  80.21,33.48 0 top
R3  4.37,15.82 90 top
R4  82.04,11.76 270 top
R5  77.04,35.03 90 top
R6  15.7,18.69 270 top
R7  9.78,5.99 90 top
R8  9.8,12.42 90 top
R9  25.96,3.76 90 top
R10  13.26,3.35 90 top
R11  78.05,33.25 90 top
R12  74.47,35.2 90 top
R13  75.64,33.17 90 top
R17  19.89,15.21 270 top
R18  17.07,15.54 270 top
R34  79.53,11.66 270 top
S3  45.62,7.85 180 top
S4  39.37,7.82 180 top
SWITCH  73.41,7.72 180 top
T1  50.95,17.02 0 top
TP1  41.91,48.9 0 bottom
TP2  41.91,46.99 0 bottom
TP3  41.91,45.09 0 bottom
TP4  41.91,43.18 0 bottom
TP5  41.91,41.27 0 bottom
TP6  41.91,39.37 0 bottom
TP7  25.25,17.3 180 bottom
TP8  25.25,19.2 180 bottom
TP9  25.25,21.11 180 bottom
TP10  25.25,23.01 180 bottom
TP11  25.25,24.92 180 bottom
TP12  67.72,51.26 270 bottom
TP13  75.29,51.1 270 bottom
TP14  71.5,51.21 270 bottom
TP15  73.36,51.13 270 bottom
TP16  69.62,51.26 270 bottom
TP17  44.09,11.02 0 top
TP18  43.99,13.97 0 top
TP19  40.79,13.92 0 top
TP20  40.82,11 0 top
TP21  35.89,17.73 0 top
U1  12.73,19.41 180 top
U2  75.64,23.04 0 top
U3  8.97,15.82 0 top
U4  18.57,22.02 270 top
U7  19.43,10.52 0 top
U$1  [TFTPLOGO]  13.41,30.63 0 top
U$2  [INVENTORCHALLENGE]  5.72,55.27 0 top
U$3  [MAKEININDIA]  59.54,54.58 0 top

### Tracks (layer width: path | path; a pad name or v marks a point on that pad's centre or on a via)
3.3V  (via drill 0.35)
  Top 0.305: U7.16 C2.1 | 80.82,31.3 80.77,31.25 | v74.6,9.58 74.65,9.52 75.72,9.52 75.81,9.44 JP1.2 | U2.2 80.8,33.39 R2.2 80.71,34.02 80.14,34.59 78.05,34.59 | TP18.1 46.05,13.97 49.5,10.51 49.5,10.26 49.76,10.01 56.2,10.01 59.71,13.51 59.89,13.51 v60.02,13.38 | R11.2 78.05,34.59 | 78.05,34.59 77.12,35.53 R5.2 76.45,35.53 75.64,34.72 | R13.2 75.64,34.72 | 75.64,34.72 74.66,35.7 R12.2
  Top 0.813: U7.4 18.8,9.8 18.07,10.53 | U7.16 14.99,11.89 15.42,11.46 17.14,11.46 18.07,10.53 | 18.07,10.53 24.98,10.53 32.99,2.51 68.02,2.51 70.41,4.9 SWITCH.A | v80.75,29.9 80.75,31.22 80.77,31.25 U2.2
  Bottom 0.305: 72.14,11.61 72.19,11.56 | 72.19,11.56 74.17,9.58 v74.6,9.58 | 70.38,9.91 70.41,9.88 | 72.19,11.56 72.03,11.56 70.38,9.91 | 70.38,9.91 70.3,9.98 63.42,9.98 60.28,13.13 60.27,13.13 v60.02,13.38
  Bottom 0.813: v80.75,29.9 80.75,16.26 79.5,15.01 75.51,15.01 74.89,14.39 74.89,14.37 74.93,14.33 74.93,11.91 74.6,11.58 72.06,11.58 70.38,9.91 70.38,7.75 SWITCH.A
!RESET!  (via drill 0.35)
  Top 0.254: 79.53,31.63 79.53,31.37 U2.3 v79.53,29.72 | Q2.3 20.85,18.69 21.08,18.69 21.59,18.18 21.59,15.77 v21.68,15.68 | 52.67,5.32 52.7,5.32 59.65,12.27 73.64,12.27 v73.94,12.57 | v38.35,5.56 38.35,6.95 38.43,7.02
  Top 0.305: S4.4 43.12,5.32 52.67,5.32 | R2.1 79.71,32.37 79.53,32.18 79.53,31.37
  Top 0.61: S4.4 38.43,7.02 S4.3
  Bottom 0.254: v73.94,12.57 74.21,12.83 74.21,14.67 75.23,15.7 79.22,15.7 80.06,16.54 80.06,29.18 v79.53,29.72 | v21.68,15.68 21.9,15.47 22.9,15.47 23.31,15.05 23.31,14.46 23.01,14.16 23.01,10.97 26.49,7.49 26.49,5.99 28.88,3.61 36.6,3.61 38.35,5.36 v38.35,5.56
BTN1  (via drill 0.35)
  Top 0.254: v35.05,60.81 39.01,60.81 v40.23,59.59
  Top 0.305: TP1.1 68.12,48.89 71.27,45.75 71.27,33.22 70.64,32.59 U2.10
  Bottom 0.254: BTN1.2 33.17,60.81 v35.05,60.81 | v40.23,59.59 40.23,50.57 TP1.1
BTN2  (via drill 0.35)
  Top 0.254: v34.75,45.57 36.17,46.99 TP2.1
  Top 0.305: TP2.1 42.42,46.99 43.66,48.23 68.14,48.23 70.81,45.56 70.81,34.14 69.37,32.69 U2.11
  Bottom 0.254: BTN2.2 34.14,45.57 v34.75,45.57
BTN3  (via drill 0.35)
  Top 0.254: v34.14,29.72 39.01,29.72 v39.93,30.63
  Top 0.305: TP3.1 43.76,46.94 43.76,47.55 68.18,47.55 70.36,45.37 70.36,34.92 68.07,32.64 68.07,31.3 U2.12
  Bottom 0.254: BTN3.2 33.02,28.6 v34.14,29.72 | v39.93,30.63 39.93,39.78 40.84,40.69 40.84,44.65 41.27,45.08 TP3.1
BTN4  (via drill 0.35)
  Top 0.254: v50.9,58.98 46.02,58.98 v44.5,57.45
  Top 0.305: v48.54,37.13 54.59,37.13 60.78,30.94 60.78,28.02 61.32,27.48 U2.16
  Bottom 0.254: BTN4.2 50.8,59.08 v50.9,58.98 | v44.5,57.45 44.5,51.36 42.98,49.83 42.98,44.25 TP4.1
  Bottom 0.305: TP4.1 42.42,43.18 46,39.6 46,38.05 46.91,37.13 v48.54,37.13
BTN5  (via drill 0.35)
  Top 0.254: v50.6,42.52 49.35,41.27 TP5.1
  Top 0.305: TP5.1 46.79,36.4 54.63,36.4 60.32,30.71 60.32,27.83 61.54,26.61 61.54,19.58 62.56,18.57 64.05,18.57 U2.23
  Bottom 0.254: BTN5.2 50.8,42.72 v50.6,42.52
BTN6  (via drill 0.35)
  Top 0.254: v48.77,27.89 46.43,27.89 v43.99,30.33
  Top 0.305: v48.77,27.89 54.1,22.55 57.54,22.55 58.07,22.02 58.55,22.02 60.22,20.35 60.22,19.02 60.91,18.34 61.26,18.34 62.25,17.35 64.05,17.35 U2.24
  Bottom 0.254: BTN6.2 48.82,27.94 v48.77,27.89 | v43.99,30.33 43.99,37.29 TP6.1
BTN7  (via drill 0.35)
  Top 0.254: v31.88,11.81 31.14,11.81 25.65,17.3 TP7.1
  Top 0.305: v37.39,18.64 39.44,18.64 39.76,18.95 43.13,18.95 44.44,20.27 56.59,20.27 57.53,19.33 57.53,15.29 v57.84,14.99 | v72.37,13.11 73.08,13.11 73.3,13.33 73.3,14.68 U2.31
  Bottom 0.254: v31.88,11.81 31.88,11.3 BTN7.2
  Bottom 0.305: TP7.1 28.81,17.3 29.72,18.21 35.61,18.21 35.81,18.41 37.17,18.41 v37.39,18.64 | v72.37,13.11 72.09,12.83 71.63,12.83 69.77,10.97 64.47,10.97 62.07,13.36 62.07,13.54 61.06,14.55 58.27,14.55 v57.84,14.99
BTN8  (via drill 0.35)
  Top 0.254: v48.77,10.21 46.33,12.65 31.19,12.65 25.25,18.59 TP8.1
  Top 0.305: v34.57,18.95 36.65,18.95 37.08,19.37 37.7,19.37 37.97,19.09 39.25,19.09 39.57,19.41 42.94,19.41 44.25,20.73 56.78,20.73 57.99,19.52 57.99,15.98 58.6,15.37 58.83,15.37 v58.88,15.32 | v71.15,13.38 71.6,13.38 71.74,13.52 71.74,14.63 U2.30
  Bottom 0.254: BTN8.2 50.75,10.21 v48.77,10.21
  Bottom 0.305: TP8.1 26.21,18.24 26.21,17.83 28.69,17.83 29.53,18.67 34.57,18.67 v34.57,18.95 | v71.15,13.38 71.15,13.16 69.42,11.43 64.81,11.43 62.53,13.7 62.53,13.73 60.94,15.32 v58.88,15.32
BTN9  (via drill 0.35)
  Top 0.254: v12.85,26.36 13.46,25.76 v18.59,25.76
  Top 0.305: v33.67,19.4 33.99,19.4 34.27,19.68 34.87,19.68 35.15,19.4 36.46,19.4 36.89,19.83 37.88,19.83 38,19.71 39.22,19.71 39.38,19.87 42.75,19.87 44.06,21.18 56.97,21.18 58.52,19.63 58.52,16.46 58.93,16.05 59.1,16.05 v59.59,16.05 | v69.32,13.26 69.32,14.74 U2.28
  Bottom 0.254: BTN9.2 12.93,26.44 v12.85,26.36 | v18.59,25.76 19.28,25.76 23.93,21.11 TP9.1
  Bottom 0.305: TP9.1 26.47,19.89 26.47,19.46 27.64,18.29 28.5,18.29 29.34,19.13 33.39,19.13 v33.67,19.4 | v69.32,13.26 69.32,12.67 68.53,11.89 65.07,11.89 60.9,16.05 v59.59,16.05
BTN10  (via drill 0.35)
  Top 0.254: v12.19,42.52 14.63,40.08 v17.98,40.08
  Top 0.305: v33.66,20.36 33.88,20.14 35.06,20.14 35.34,19.86 36.27,19.86 36.7,20.29 38.07,20.29 38.19,20.17 39.03,20.17 39.19,20.32 42.56,20.32 43.88,21.64 57.16,21.64 58.98,19.82 58.98,18.01 59.69,17.3 v59.74,17.3 | v68.05,13.11 68.05,14.74 U2.27
  Bottom 0.254: BTN10.2 12.19,43.69 v12.19,42.52 | v17.98,40.08 24.08,33.98 24.08,26.06 23.7,25.68 23.7,23.8 24.56,22.94 25.17,22.94 TP10.1
  Bottom 0.305: TP10.1 26.29,21.97 26.29,20.71 26.92,20.08 26.92,19.65 27.57,19 28.57,19 29.15,19.58 32.81,19.58 33.37,20.14 33.43,20.14 v33.66,20.36 | v59.74,17.3 60.53,16.51 61.09,16.51 65.26,12.34 67.29,12.34 v68.05,13.11
BTN11  (via drill 0.35)
  Top 0.254: v11.58,58.98 13.41,57.15 v17.98,57.15
  Top 0.305: v32.64,20.45 32.7,20.45 33.35,21.1 33.96,21.1 34.46,20.59 35.25,20.59 35.53,20.32 36.08,20.32 36.51,20.74 38.26,20.74 38.38,20.62 38.84,20.62 39,20.78 42.37,20.78 43.69,22.1 57.35,22.1 59.44,20.01 59.44,19.68 59.64,19.48 59.64,18.72 60.76,17.6 v60.96,17.6 | v66.73,13.18 66.73,14.69 U2.26
  Bottom 0.254: BTN11.2 11.43,59.13 v11.58,58.98 | v17.98,57.15 25.25,49.89 TP11.1
  Bottom 0.305: TP11.1 26.39,23.77 26.39,22.52 26.75,22.16 26.75,21.36 27.64,20.47 27.64,19.58 27.66,19.56 28.48,19.56 28.96,20.04 32.23,20.04 v32.64,20.45 | v60.96,17.6 61.49,17.07 61.49,16.76 65.45,12.8 66.34,12.8 v66.73,13.18
CH340-DTR
  Top 0.254: Q2.1 20.48,17.61 19.89,17.02 R17.1 19.75,15.71 18.77,14.73 18.77,13.34 U7.13
CH340-RTS
  Top 0.254: R18.1 17.07,16.13 | Q2.4 18.25,18.91 17.35,18.01 17.35,16.41 17.07,16.13 | U7.14 17.53,13.87 16.99,14.4 15.98,14.4 15.98,15.04 17.07,16.13
CH340-RX  (via drill 0.35)
  Top 0.305: U7.3 17.53,9.42 v17.48,9.47 | v19.52,11.52 19.55,11.54 24.98,11.54 33.17,3.35 54.13,3.35 61.09,10.31 76.84,10.31 78.33,11.81 78.33,14.73 U2.35
  Bottom 0.305: v17.48,9.47 v19.52,11.52
CH340-TX  (via drill 0.35)
  Top 0.305: U7.2 16.26,9.8 v16.43,9.98 | v18.44,11.56 19.13,12.25 19.83,12.25 19.86,12.22 25.73,12.22 33.93,4.01 53.8,4.01 53.8,4.04 60.58,10.82 76.43,10.82 76.99,11.38 U2.34
  Bottom 0.305: v16.43,9.98 18.01,11.56 v18.44,11.56
CHG
  Top 0.305: U1.1 13.68,19.87 12.83,19.02 10.64,19.02 8.2,21.46 5.26,21.46 4.37,20.57 D1.C
CHG_LED
  Top 0.305: D1.A R3.2
CNT  (via drill 0.35)
  Top 0.305: U2.9 71.91,45.89 67.72,50.09 TP12.1 70.21,53.75 v76.78,53.75
  Bottom 0.305: 5WAYSWITCH.3 77.14,54.1 v76.78,53.75
D+
  Top 0.203: J1.A6 19.26,6.81 19.94,7.49 | U7.5 20.07,7.62 19.94,7.49 | J1.B6 20.26,7.17 19.94,7.49
D-  (via drill 0.35)
  Top 0.203: J1.A7 19.76,5.62 v20.5,4.88 19.25,4.88 18.76,5.37 J1.B7 | v21.34,9.4 U7.6
  Bottom 0.203: v20.5,4.88 20.5,4.89 21.34,5.73 v21.34,9.4
DTR-10K  (via drill 0.35)
  Top 0.254: R17.2 20.77,15.6 v20.77,16.13 | v18.14,16.69 18.03,16.79 18.03,17.98 18.31,18.26 Q2.5
  Bottom 0.254: v20.77,16.13 20.21,16.69 v18.14,16.69
DWN
  Top 0.254: R12.1 74.47,32.66 74.47,31.3 U2.7
  Top 0.305: TP16.1 69.62,48.83 72.37,46.08 72.37,33.8 73.51,32.66 74.47,32.66
  Bottom 0.305: 5WAYSWITCH.6 67.79,57.66 69.62,55.83 TP16.1
ESP_0/QPWR  (via drill 0.35)
  Top 0.254: Q2.6 19.04,17.61 19.56,18.14 19.56,19.76 21.85,19.76 22.75,18.86 22.75,18.55 22.53,18.33 22.53,15.38 22.61,15.3 v22.61,14.76 | U2.25 65.56,14.99 65.61,14.94 65.61,13.03 65.25,12.67 59.48,12.67 52.56,5.75 48.96,5.75 S3.4 44.09,10.62 TP17.1 | v44.93,6.07 44.93,6.08 43.97,7.05
  Top 0.61: S3.4 43.97,7.05 S3.3
  Bottom 0.254: v22.61,14.76 22.61,10.8 26.09,7.32 26.09,5.82 28.71,3.2 42.06,3.2 v44.93,6.07
ESP_21/TP_SDA
  Top 0.254: U4.8 19.63,22.7 20.1,22.7 23.57,19.23 23.57,18.22 23.34,17.99 23.34,15.77 24,15.11 24.63,15.11 25.2,14.54 25.2,14.16 34.51,4.85 52.81,4.85 59.82,11.86 74.85,11.86 75.03,12.04 75.03,13.18 75.72,13.87 U2.33
ESP_22/TP_SCL  (via drill 0.35)
  Top 0.254: v76.1,13.16 76.1,11.79 75.64,11.33 60.12,11.33 53.24,4.44 34.34,4.44 26.04,12.75 25.5,12.75 24.79,13.46 24.79,14.38 24.46,14.71 23.77,14.71 22.94,15.54 22.94,18.16 23.17,18.39 23.17,19.02 20.19,22 20.19,22.04 19.95,22.27 U4.7 | v79.43,13.23 79.43,14.69 U2.36
  Bottom 0.254: v76.1,13.16 79.35,13.16 v79.43,13.23
GND  (via drill 0.35)
  Top 0.254: U4.1
  Top 0.305: J1.GND 16.28,6.34 15.6,7.03 15.6,7.26 15.14,7.72 U7.1 | J1.GND2 22.73,6.44 23.27,6.98 23.27,8.81 | U4.6 19.13,21.77 18.88,22.02 U4.9 18.57,22.36 18.16,22.77 U4.1
  Top 0.406: S3.1 45.57,10.75 45.57,11.63 45.06,12.14 42.44,12.14 42.44,10.16 v42.47,10.13 | v42.47,10.13 41.42,9.09 S4.1 S4.2 | v42.47,10.13 42.47,9.75 S3.2
  Top 0.61: C7.2 8.97,13.54 U3.2 9.18,14.74 9.18,15.31 9.45,15.58 10.38,15.58 10.67,15.29 10.69,15.29 10.77,15.22 10.77,12.26 12.27,10.76 v12.27,10.52 | v14.99,9.75 U7.1 | U1.2 12.73,20.13 12.23,19.63 12.09,19.63
  Bottom 0.254: BTN8.1 BTN6.1 BTN5.1 BTN4.1 55.88,64.97 52.88,67.97 | BTN7.1 BTN3.1 BTN2.1 BTN1.1 38.1,64.68 37.81,65.08 37.04,65.84 34.9,67.97 | BTN9.1 BTN10.1 BTN11.1 16.51,66.04 18.44,67.97 34.9,67.97 | BTN9.1 16.51,27.53 16.76,27.28 16.76,27.69 BTN9.1 | 52.88,67.97 73.33,67.97 5WAYSWITCH.1 | 52.88,67.97 34.9,67.97
  Bottom 0.61: v12.27,10.52 14.22,10.52 v14.99,9.75
  other vias: 10.95,10.95 9.7,3.68 76.15,4.42 5.77,18.59 10.57,18.26 15.09,16.18 10.31,20.68 9.35,21.67 42.47,15.06 4.45,24.36 57.56,13.51 63.83,37.06
  pour Bottom: 81.36,69.88 2.46,69.88 arc90 -0.05,67.36 -0.05,4.19 arc90 2.92,1.22 81.33,1.22 arc90 83.82,3.71 83.82,67.41 arc90
  pour Top: 81.41,69.9 2.51,69.9 arc90 -0.05,67.34 -0.05,4.34 arc90 3.07,1.22 81.51,1.22 arc90 83.82,3.53 83.82,67.49 arc90
LFT  (via drill 0.35)
  Top 0.254: R11.1 78.05,32.51 78.36,32.21 78.36,31.37 U2.4
  Top 0.305: TP13.1 75.29,47.42 73.84,45.97 73.84,38.88 75.18,37.54 75.18,36.96 v75.39,36.75 | v78.21,29.67 78.36,29.82 78.36,31.37
  Bottom 0.305: v75.39,36.75 75.39,32.49 v78.21,29.67 | TP13.1 74.55,51.84 74.55,58.77 5WAYSWITCH.2
MOTOR  (via drill 0.35)
  Top 0.305: R1.1 48.27,12.81 50.57,10.51 56.06,10.51 59.66,14.12 60.43,14.12 v61.06,13.49 | v73.18,29.64 v73.18,29.65 U2.8
  Bottom 0.305: v61.06,13.49 61.06,13.09 63.71,10.44 69.91,10.44 71.76,12.29 73,12.29 73.21,12.5 73.21,12.87 73.74,13.4 73.74,14.81 75.05,16.13 75.82,16.13 75.87,16.18 79.09,16.18 79.63,16.72 79.63,27.69 78.61,28.7 74.12,28.7 v73.18,29.64
N$1
  Top 0.508: T1.1 50,16.42 48.89,17.53 46.76,17.53 46.56,17.32 46.56,15.91 R1.2
N$3
  Top 0.813: M1.- 43.51,16.99 43.55,16.95 45.03,16.95 46.42,18.34 49.23,18.34 49.45,18.12 T1.3 54.9,18.12 D2.A
N$4
  Top 0.254: R34.1 77.8,10.43 77.8,8.64 77.72,8.56 JP1.1
N$5  (via drill 0.35)
  Top 0.203: R9.2 23.84,4.26 23.09,3.5 v22.58,3.5 | v20.79,3.82 21.18,4.21 21.18,5.58 21.26,5.65 J1.B5
  Bottom 0.203: v20.79,3.82 21.12,3.49 22.57,3.49 v22.58,3.5
N$6  (via drill 0.35)
  Top 0.203: R10.2 16.7,3.85 v16.92,3.63 | v18.44,4.01 18.44,5.18 18.26,5.36 J1.A5
  Bottom 0.203: v16.92,3.63 17.93,3.63 18.31,4.01 v18.44,4.01
N$7
  Top 0.254: D3.A 82.07,11.23 R4.2
N$14
  Top 0.61: U1.5 13.94,17.84 R6.2
N$30
  Top 0.254: R34.2 79.15,10.78 D12.A
RGT  (via drill 0.35)
  Top 0.254: R5.1 77.04,31.32 U2.5
  Top 0.305: v74.45,37.24 74.06,37.62 74.06,37.97 73.36,38.68 TP15.1 | v76.86,29.67 76.99,29.8 U2.5 | v73.43,58.55 71.91,60.07 v68.58,60.07
  Bottom 0.305: v74.45,37.24 74.45,32.08 v76.86,29.67 | TP15.1 73.36,58.47 v73.43,58.55 | v68.58,60.07 67.29,61.36 5WAYSWITCH.5
RTS-10K
  Top 0.254: Q2.2 20.32,18.26 19.33,17.28 19.33,16.38 17.99,15.04 R18.2
STATUS_LED
  Top 0.254: R4.1 82.04,12.59 80.8,13.83 U2.37
SWITCH  (via drill 0.35)
  Top 0.61: C10.1 7.26,19.52 8.23,19.52 | 8.23,19.52 C1.1 | 8.23,19.52 8.02,19.31 U3.5
  Top 0.813: U3.5 5.71,17.12 v5.69,17.14
  Bottom 0.813: v5.69,17.14 5.18,17.14 4.57,16.54 4.57,13.33 5.23,12.67 19.76,12.67 25.38,7.06 25.38,5.56 28.42,2.51 65.99,2.51 67.41,3.93 SWITCH.COM
TP_EN
  Top 0.406: U3.3 9.92,13.03 R8.2
UP  (via drill 0.35)
  Top 0.254: R13.1 75.64,32.31 75.77,32.18 75.77,31.32 U2.6
  Top 0.305: TP14.1 71.5,47.6 72.83,46.27 72.83,38.17 v73.33,37.67 | v75.67,29.67 75.77,29.77 75.77,31.32
  Bottom 0.305: v73.33,37.67 73.33,32 v75.67,29.67 | TP14.1 71.5,63.25 69.52,65.23 66.41,65.23 5WAYSWITCH.4
V_BATT
  Top 0.305: 11.74,21.95 14.95,21.95 C15.1 16.59,22.05 16.81,22.27 | 16.81,22.27 U4.2 U4.3 | TP20.1 39.9,10.08 30.68,10.08 24.31,16.45 24.31,19.1 20.18,23.23 17.1,23.23 16.92,23.05 16.92,22.38 16.81,22.27
  Top 0.61: 11.74,20.74 U1.3
  Top 0.813: 11.74,20.74 11.74,21.95 C6.1 2.77,22.78 2.69,22.86 | 2.69,22.86 2.69,26.54 BAT.2 5.23,26.54 6.02,27.33 6.02,39.6 5.6,40.02 J4.2 | 2.69,22.86 2.69,13.13 6.66,9.17 Q3.3
V_USB  (via drill 0.35)
  Top 0.305: J1.VBUS2 21.96,5.7 21.59,5.33 21.59,3.56 21.08,3.05 v19.61,3.05 18.29,3.05 17.68,3.66 17.68,5.08 17.06,5.7 J1.VBUS1 | R3.1 5.72,15.32 6.56,16.16 8.36,16.16 8.6,16.4 8.6,16.42 8.66,16.48 9.25,16.48 9.52,16.22 11.66,16.22 11.78,16.1 | TP19.1 39.95,13.08 31.57,13.08 26,18.66 26,19.51 25.56,19.95 24.11,19.95 20.37,23.68 16.91,23.68 16.46,23.24 16.46,23.13 v16.13,22.79 | v12.65,17.83 12.27,17.45 11.78,17.45
  Top 0.61: v13.46,6.4 13.39,6.47 | 13.39,6.47 D4.A 11.79,6.49 R7.2 9.79,6.5 Q3.1 | 13.39,6.47 13.39,10.97 11.74,12.62 11.74,15.71 C19.1 11.78,16.1 11.78,17.45 U1.4
  Bottom 0.305: v16.13,22.79 12.65,19.31 v12.65,17.83
  Bottom 0.61: v19.61,3.05 19.61,5.05 17.5,7.16 14.22,7.16 v13.46,6.4
VIN  (via drill 0.35)
  Top 0.305: D2.C 54.94,14.08
  Top 0.61: 11.81,9.27 D4.C | Q3.2 9.8,10.14 | 8.55,11.97 C7.1 | U3.1 6.32,14.52 v5.99,14.2 | 54.94,14.08 55.51,14.08 56.87,15.44 56.87,19.13 56.34,19.66 45.45,19.66 M1.+ 40.01,18.34 39.34,17.68 v37.19,17.68 35.94,17.68 TP21.1
  Top 0.813: Q3.2 10.21,9.7 11.38,9.7 11.81,9.27 | 9.8,10.14 R8.1 9.75,11.97 8.55,11.97 7.59,11.97 7.54,12.01 7.54,13.64 8.02,14.11 U3.1
  Bottom 0.61: v5.99,14.2 15.21,14.2 17.09,16.08 17.09,16.99 17.19,16.99 17.77,17.57 20.58,17.57 21.16,16.99 22.1,16.99 22.63,16.46 22.63,16.05 23.14,16.05 24.79,14.4 26.77,14.4 29.97,17.6 35.86,17.6 35.94,17.68 v37.19,17.68

### Text on the board
tNames: TIPO BLE V1 | CNT | DWN | UP | RGT | LFT | BTN1 | BTN2 | BTN3 | BTN4 | BTN5 | BTN6 | BTN11 | BTN10 | BTN9 | BTN8 | VIN | BTN7 | V_USB | 3.3V | V_BATT | QPWR | Design by @vjvarada
bNames: BTN8 | BTN7